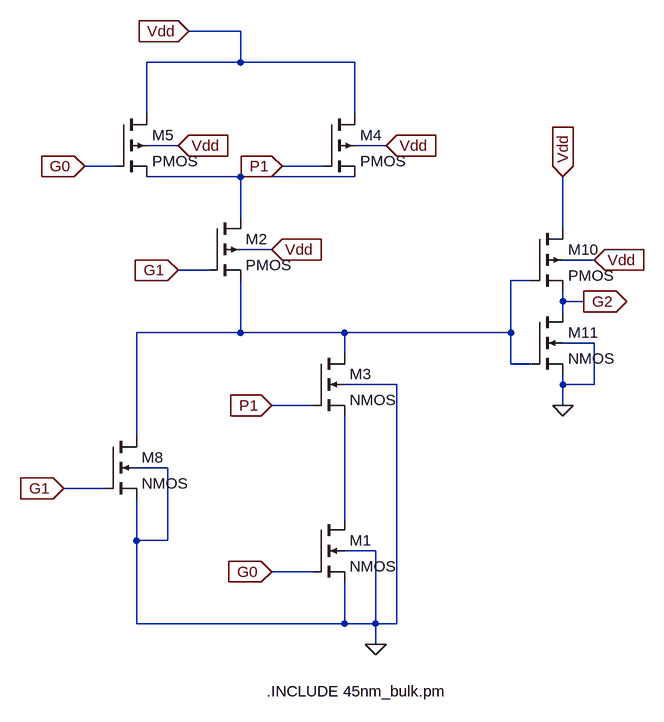
[diagram p0: schematic group_generation.asc]
group_generation.asc, the LTspice schematic file:
Version 4
SHEET 1 1608 792
WIRE -128 -256 -208 -256
WIRE -128 -208 -128 -256
WIRE -128 -208 -272 -208
WIRE 48 -208 -128 -208
WIRE -272 -128 -272 -208
WIRE 48 -128 48 -208
WIRE -224 -80 -272 -80
WIRE 96 -80 48 -80
WIRE -320 -48 -368 -48
WIRE 0 -48 -64 -48
WIRE -128 -32 -272 -32
WIRE 48 -32 -128 -32
WIRE -128 32 -128 -32
WIRE 368 48 368 -32
WIRE -80 80 -128 80
WIRE 416 96 368 96
WIRE -176 112 -224 112
WIRE 320 128 288 128
WIRE 368 160 368 144
WIRE 400 160 368 160
WIRE 368 176 368 160
WIRE -128 208 -128 128
WIRE -128 208 -288 208
WIRE 32 208 -128 208
WIRE 288 208 288 128
WIRE 288 208 32 208
WIRE 416 224 368 224
WIRE 32 240 32 208
WIRE 288 256 288 208
WIRE 320 256 288 256
WIRE 112 288 32 288
WIRE 368 288 368 272
WIRE 416 288 416 224
WIRE 416 288 368 288
WIRE -16 320 -80 320
WIRE 368 320 368 288
WIRE -288 368 -288 208
WIRE -240 416 -288 416
WIRE -336 448 -400 448
WIRE 32 496 32 336
WIRE -288 528 -288 464
WIRE -240 528 -240 416
WIRE -240 528 -288 528
WIRE 80 544 32 544
WIRE -16 576 -80 576
WIRE -288 656 -288 528
WIRE 32 656 32 592
WIRE 32 656 -288 656
WIRE 80 656 80 544
WIRE 80 656 32 656
WIRE 112 656 112 288
WIRE 112 656 80 656
WIRE 80 688 80 656
FLAG -80 576 G0
IOPIN -80 576 In
FLAG -80 320 P1
IOPIN -80 320 In
FLAG -208 -256 Vdd
IOPIN -208 -256 In
FLAG 80 688 0
FLAG 368 -32 Vdd
IOPIN 368 -32 In
FLAG 416 96 Vdd
IOPIN 416 96 In
FLAG 400 160 G2
IOPIN 400 160 Out
FLAG 368 320 0
FLAG -400 448 G1
IOPIN -400 448 In
FLAG 96 -80 Vdd
IOPIN 96 -80 In
FLAG -368 -48 G0
IOPIN -368 -48 In
FLAG -224 -80 Vdd
IOPIN -224 -80 In
FLAG -224 112 G1
IOPIN -224 112 In
FLAG -80 80 Vdd
IOPIN -80 80 In
FLAG -64 -48 P1
IOPIN -64 -48 In
SYMBOL nmos4 -16 496 R0
SYMATTR InstName M1
SYMATTR Value2 l=45n w=90n
SYMBOL nmos4 -16 240 R0
SYMATTR InstName M3
SYMATTR Value2 l=45n w=90n
SYMBOL pmos4 320 48 R0
SYMATTR InstName M10
SYMATTR Value2 l=45n w=90n
SYMBOL nmos4 320 176 R0
SYMATTR InstName M11
SYMATTR Value2 l=45n w=45n
SYMBOL nmos4 -336 368 R0
SYMATTR InstName M8
SYMATTR Value2 l=45n w=45n
SYMBOL pmos4 0 -128 R0
SYMATTR InstName M4
SYMATTR Value2 l=45n w=180n
SYMBOL pmos4 -320 -128 R0
SYMATTR InstName M5
SYMATTR Value2 l=45n w=180n
SYMBOL pmos4 -176 32 R0
SYMATTR InstName M2
SYMATTR Value2 l=45n w=180n
TEXT -88 760 Left 2 !.INCLUDE 45nm_bulk.pm

The netlist it stands for:
* group_generation.asc
M1 N003 G0 0 0 NMOS l=45n w=90n
M3 N002 P1 N003 0 NMOS l=45n w=90n
M10 Vdd N002 G2 Vdd PMOS l=45n w=90n
M11 G2 N002 0 0 NMOS l=45n w=45n
M8 N002 G1 0 0 NMOS l=45n w=45n
M4 Vdd P1 N001 Vdd PMOS l=45n w=180n
M5 Vdd G0 N001 Vdd PMOS l=45n w=180n
M2 N001 G1 N002 Vdd PMOS l=45n w=180n
.model NMOS NMOS
.model PMOS PMOS
.lib standard.mos
.INCLUDE 45nm_bulk.pm
.backanno
.end